# Altium schematic sheet Sch_BTL.SchDoc
size Letter
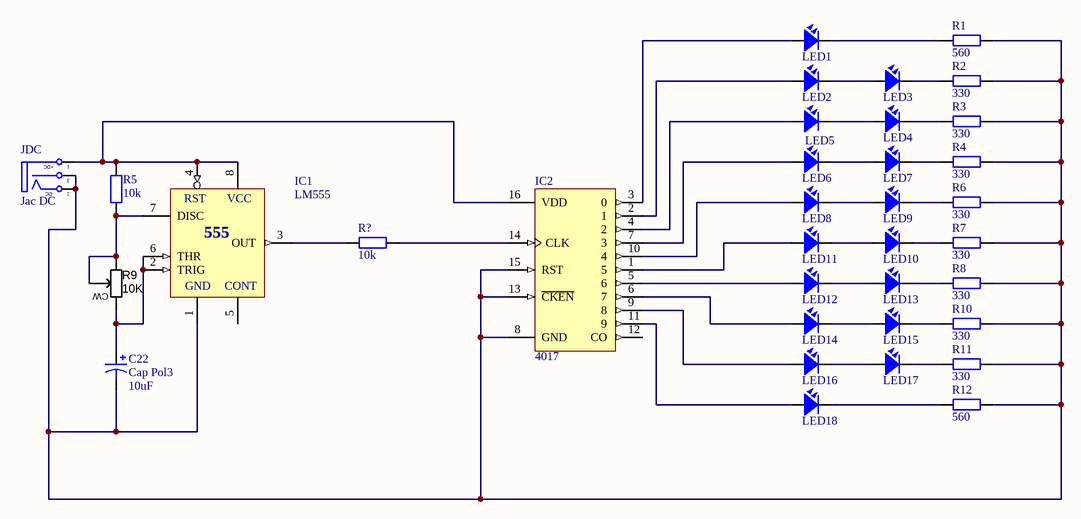
[diagram p0: Sch_BTL.SchDoc]

## Parts
C22  Cap Pol3  value 10uF  [CP2/5]
IC1  LM555  [DIP8/W0.3]
IC2  4017  [DIP16/W0.3]
JDC  Jac DC  [DC-IN]
LED1  LED  [LED-5-RED]  (value not drawn)
LED2  LED  [LED-5-RED]  (value not drawn)
LED3  LED  [LED-5-RED]  (value not drawn)
LED4  LED  [LED-5-RED]  (value not drawn)
LED5  LED  [LED-5-RED]  (value not drawn)
LED6  LED  [LED-5-RED]  (value not drawn)
LED7  LED  [LED-5-RED]  (value not drawn)
LED8  LED  [LED-5-RED]  (value not drawn)
LED9  LED  [LED-5-RED]  (value not drawn)
LED10  LED  [LED-5-RED]  (value not drawn)
LED11  LED  [LED-5-RED]  (value not drawn)
LED12  LED  [LED-5-RED]  (value not drawn)
LED13  LED  [LED-5-RED]  (value not drawn)
LED14  LED  [LED-5-RED]  (value not drawn)
LED15  LED  [LED-5-RED]  (value not drawn)
LED16  LED  [LED-5-RED]  (value not drawn)
LED17  LED  [LED-5-RED]  (value not drawn)
LED18  LED  [LED-5-RED]  (value not drawn)
R1  560  [R1/4W]
R2  330  [R1/4W]
R3  330  [R1/4W]
R4  330  [R1/4W]
R5  10k  [R1/4W]
R6  330  [R1/4W]
R7  330  [R1/4W]
R8  330  [R1/4W]
R9  value 10K  [TRIMPOT_THT_PV36X]  (hidden comment: 25 turns)
R10  330  [R1/4W]
R11  330  [R1/4W]
R12  560  [R1/4W]
R?  10k  [R1/4W]

## Nets
NetC22_1: C22.1 IC1.2(TRIG) IC1.6(THR) R9.CW
NetC22_2: C22.2 IC1.1(GND) IC2.8(GND) IC2.13(~{CKEN}) IC2.15(RST) JDC.2(TN) JDC.3(S) R1.2 R2.2 R3.2 R4.2 R6.2 R7.2 R8.2 R10.2 R11.2 R12.2
NetIC1_3: IC1.3(OUT) R?.1
NetIC1_4: IC1.4(RST) IC1.8(VCC) IC2.16(VDD) JDC.1(T) R5.2
NetIC1_7: IC1.7(DISC) R5.1 R9.CCW R9.W
NetIC2_1: IC2.1(5) LED11.1
NetIC2_2: IC2.2(1) LED2.1
NetIC2_3: IC2.3(0) LED1.1
NetIC2_4: IC2.4(2) LED5.1
NetIC2_5: IC2.5(6) LED12.1
NetIC2_6: IC2.6(7) LED14.1
NetIC2_7: IC2.7(3) LED6.1
NetIC2_9: IC2.9(8) LED16.1
NetIC2_10: IC2.10(4) LED8.1
NetIC2_11: IC2.11(9) LED18.1
NetIC2_14: IC2.14(CLK) R?.2
NetLED1_2: LED1.2 R1.1
NetLED2_2: LED2.2 LED3.1
NetLED3_2: LED3.2 R2.1
NetLED4_1: LED4.1 LED5.2
NetLED4_2: LED4.2 R3.1
NetLED6_2: LED6.2 LED7.1
NetLED7_2: LED7.2 R4.1
NetLED8_2: LED8.2 LED9.1
NetLED9_2: LED9.2 R6.1
NetLED10_1: LED10.1 LED11.2
NetLED10_2: LED10.2 R7.1
NetLED12_2: LED12.2 LED13.1
NetLED13_2: LED13.2 R8.1
NetLED14_2: LED14.2 LED15.1
NetLED15_2: LED15.2 R10.1
NetLED16_2: LED16.2 LED17.1
NetLED17_2: LED17.2 R11.1
NetLED18_2: LED18.2 R12.1

Not connected (* = marked no-connect by the designer): IC1 5(CONT); IC2 12(CO)

## Notes on the sheet
- (in symbol DCIN) +DC; -DC
- (in symbol LM555) 555

## Library data of the parts
C22 = Cap Pol3: Polarized Capacitor (Surface Mount); VALUE: C?; LatestRevisionDate: 17-Jul-2002; LatestRevisionNote: Re-released for DXP Platform.; PackageReference: C0805; Publisher: Altium Limited
IC1 = LM555: Timer; Value: LM555
IC2 = 4017: Decade Counter/Divider with 10 Decoded Outputs; Designed by: VanDungEvn; Value: CD4017
JDC = DCIN: Jac DC input; Value: Jac DC
LED1-LED18 = LED: LED Single colour Green and Red; Value: LED 3 ly Single Colour
R1-R8 R10-R12 R? = R1/4W: Resistor 1/4W; Value: R1/4W - 1K
R9 = RES_TRIMMER_10K_25T_THT: Trimmer THD 10K 500mW 25-turn; Manufacturer 1: Murata Electronics North America; Manufacturer Part Number 1: PV36X103C01B00; Tolerance: ±10%; Ratings: 1/2W; ±100ppm/°C; SCDType: spec; Material: Cermet; Package / Case: 10.9mm L x 5.0mm W x 10.0mm H; Supplier 1: Digi-Key; Supplier Part Number 1: 490-2894-ND